# Altium schematic sheet BMS Sense Board.SchDoc
size A4
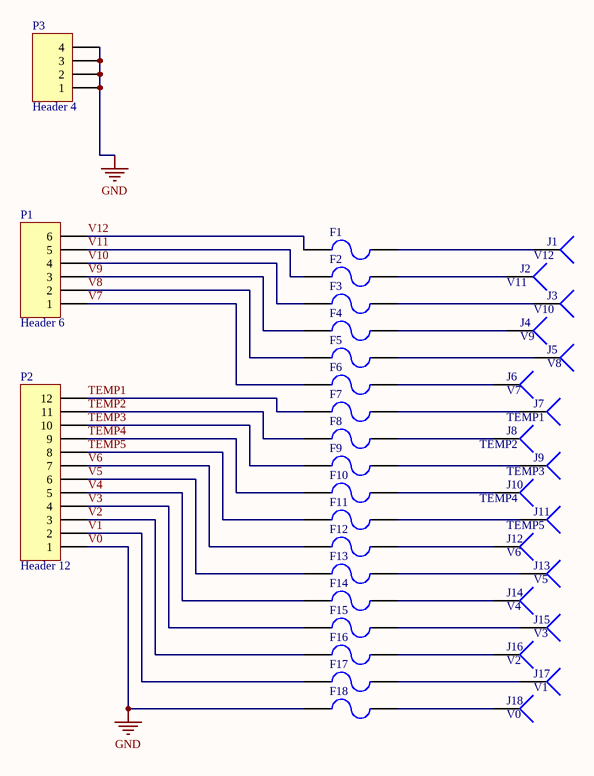
[diagram p0: BMS Sense Board.SchDoc]

## Parts
F1  Fuse 2  [6-0805_L]  (value not drawn)
F2  Fuse 2  [6-0805_L]  (value not drawn)
F3  Fuse 2  [6-0805_L]  (value not drawn)
F4  Fuse 2  [6-0805_L]  (value not drawn)
F5  Fuse 2  [6-0805_L]  (value not drawn)
F6  Fuse 2  [6-0805_L]  (value not drawn)
F7  Fuse 2  [6-0805_L]  (value not drawn)
F8  Fuse 2  [6-0805_L]  (value not drawn)
F9  Fuse 2  [6-0805_L]  (value not drawn)
F10  Fuse 2  [6-0805_L]  (value not drawn)
F11  Fuse 2  [6-0805_L]  (value not drawn)
F12  Fuse 2  [6-0805_L]  (value not drawn)
F13  Fuse 2  [6-0805_L]  (value not drawn)
F14  Fuse 2  [6-0805_L]  (value not drawn)
F15  Fuse 2  [6-0805_L]  (value not drawn)
F16  Fuse 2  [6-0805_L]  (value not drawn)
F17  Fuse 2  [6-0805_L]  (value not drawn)
F18  Fuse 2  [6-0805_L]  (value not drawn)
J1  V12  [PAD]
J2  V11  [PAD]
J3  V10  [PAD]
J4  V9  [PAD]
J5  V8  [PAD]
J6  V7  [PAD]
J7  TEMP1  [PAD]
J8  TEMP2  [PAD]
J9  TEMP3  [PAD]
J10  TEMP4  [PAD]
J11  TEMP5  [PAD]
J12  V6  [PAD]
J13  V5  [PAD]
J14  V4  [PAD]
J15  V3  [PAD]
J16  V2  [PAD]
J17  V1  [PAD]
J18  V0  [PAD]
P1  Header 6  [HDR2X3_CEN]
P2  Header 12  [HDR2X6]
P3  Header 4  [HDR2X2]

## Nets
V0: F18.1 P2.8(1) P3.1 P3.2 P3.3 P3.4  [also labelled GND]
TEMP1: F7.1 P2.10(12)
TEMP2: F8.1 P2.12(11)
TEMP3: F9.1 P2.11(10)
TEMP4: F10.1 P2.9
TEMP5: F11.1 P2.7(8)
V1: F17.1 P2.6(2)
V2: F16.1 P2.4(3)
V3: F15.1 P2.2(4)
V4: F14.1 P2.1(5)
V5: F13.1 P2.3(6)
V6: F12.1 P2.5(7)
V7: F6.1 P1.5(1)
V8: F5.1 P1.4(2)
V9: F4.1 P1.1(3)
V10: F3.1 P1.2(4)
V11: F2.1 P1.3(5)
V12: F1.1 P1.6
NetF1_2: F1.2 J1.1
NetF2_2: F2.2 J2.1
NetF3_2: F3.2 J3.1
NetF4_2: F4.2 J4.1
NetF5_2: F5.2 J5.1
NetF6_2: F6.2 J6.1
NetF7_2: F7.2 J7.1
NetF8_2: F8.2 J8.1
NetF9_2: F9.2 J9.1
NetF10_2: F10.2 J10.1
NetF11_2: F11.2 J11.1
NetF12_2: F12.2 J12.1
NetF13_2: F13.2 J13.1
NetF14_2: F14.2 J14.1
NetF15_2: F15.2 J15.1
NetF16_2: F16.2 J16.1
NetF17_2: F17.2 J17.1
NetF18_2: F18.2 J18.1

## Library data of the parts
F1-F18 = Fuse 2: Fuse; Published: 8-Jun-2000; LatestRevisionDate: 17-Jul-2002; LatestRevisionNote: Re-released for DXP Platform.; PackageReference: PIN-W2/E2.8; Publisher: Altium Limited; PackageDescription: Thru-Hole; 2 Leads
J1-J18 = Socket: LatestRevisionDate: 17-Jul-2002; LatestRevisionNote: Re-released for DXP Platform.; Publisher: Altium Limited
P1 = Header 6: Header, 6-Pin; LatestRevisionDate: 17-Jul-2002; LatestRevisionNote: Re-released for DXP Platform.; Publisher: Altium Limited
P2 = Header 12: Header, 12-Pin; LatestRevisionDate: 17-Jul-2002; LatestRevisionNote: Re-released for DXP Platform.; Publisher: Altium Limited
P3 = Header 4: Header, 4-Pin; LatestRevisionDate: 17-Jul-2002; LatestRevisionNote: Re-released for DXP Platform.; Publisher: Altium Limited